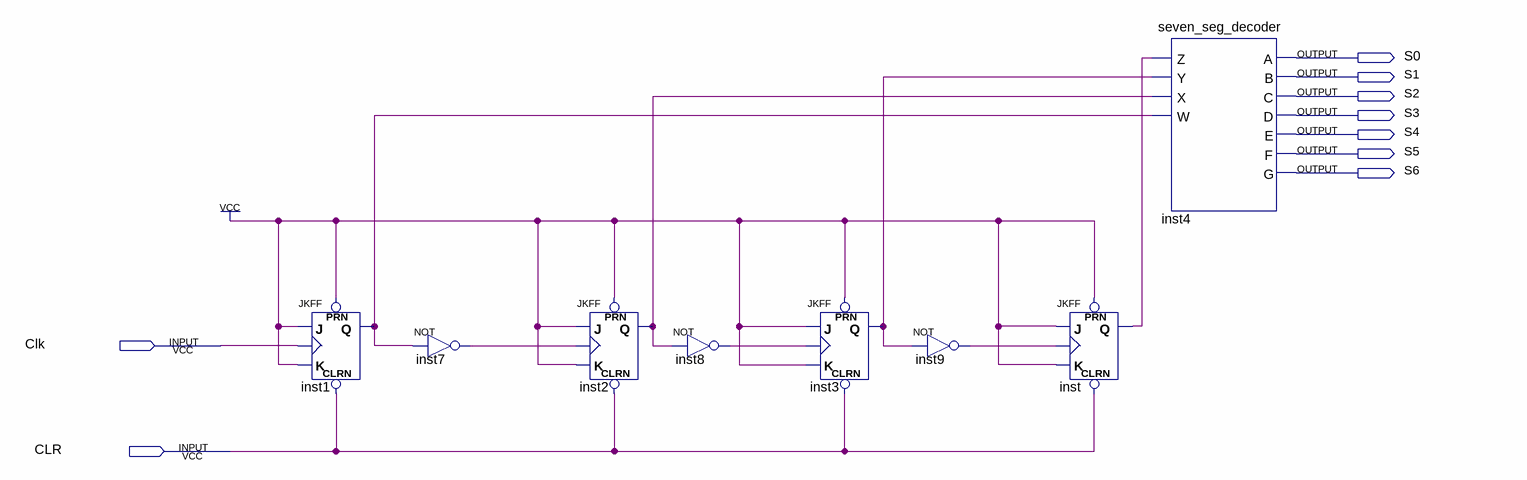
[diagram p0: schematic sheet]
// Quartus schematic lab10step3a.bdf as structural Verilog: 8 symbols, 9 pins
module lab10step3a (
  input  Clk,
  input  CLR,
  output S0,
  output S1,
  output S2,
  output S3,
  output S4,
  output S5,
  output S6
);

  wire inst1_q, inst2_q, inst3_q, inst7_out, inst8_out, inst9_out, inst_q;

  JKFF inst1 (.PRN(1'b1), .CLRN(CLR), .K(1'b1), .J(1'b1), .CLK(Clk), .Q(inst1_q));
  not inst7 (inst7_out, inst1_q);
  JKFF inst2 (.PRN(1'b1), .CLRN(CLR), .K(1'b1), .J(1'b1), .CLK(inst7_out), .Q(inst2_q));
  not inst8 (inst8_out, inst2_q);
  JKFF inst3 (.PRN(1'b1), .CLRN(CLR), .K(1'b1), .J(1'b1), .CLK(inst8_out), .Q(inst3_q));
  not inst9 (inst9_out, inst3_q);
  JKFF inst (.PRN(1'b1), .CLRN(CLR), .K(1'b1), .J(1'b1), .CLK(inst9_out), .Q(inst_q));
  seven_seg_decoder inst4 (
    .Z(inst_q), .Y(inst3_q), .X(inst2_q), .W(inst1_q), .A(S0), .B(S1), .C(S2), .D(S3), .E(S4), .F(S5), .G(S6));
endmodule
